# EAGLE schematic V1 (EAGLE 8.5.1)

## Sheet 1 of 2
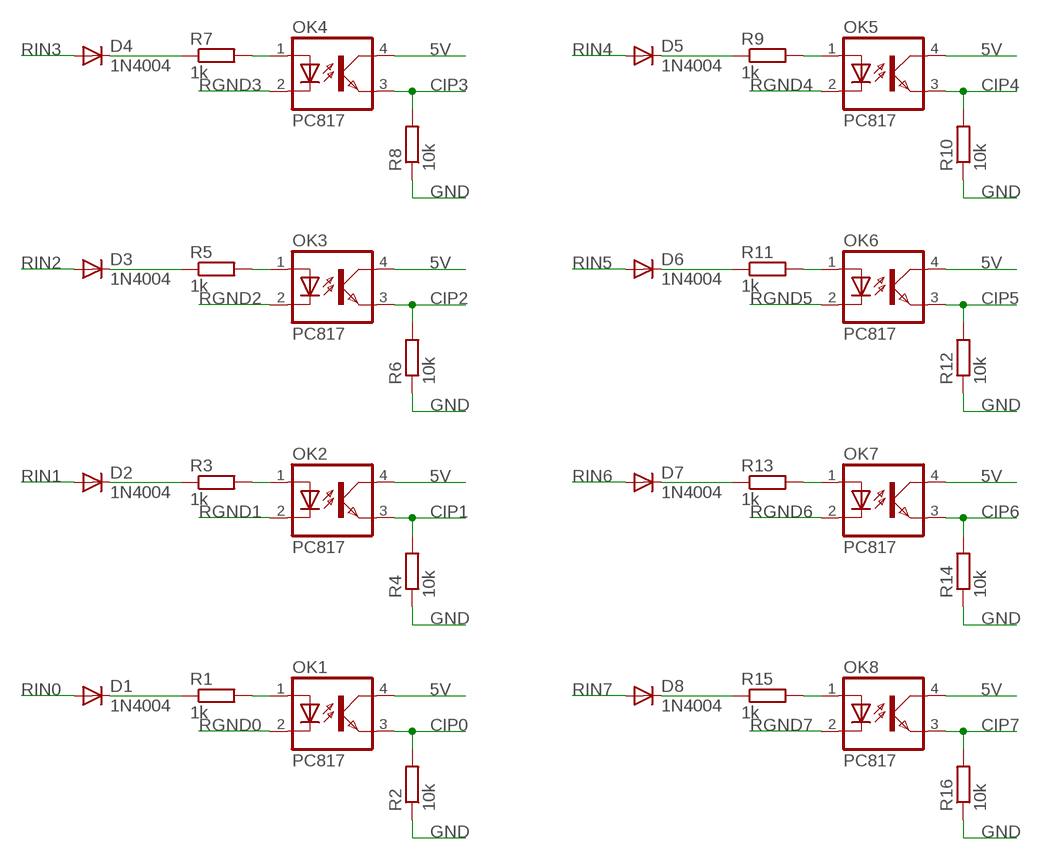
[diagram p0: schematic, sheet 1]

### Parts
D1  1N4004  [DO41-10]
D2  1N4004  [DO41-10]
D3  1N4004  [DO41-10]
D4  1N4004  [DO41-10]
D5  1N4004  [DO41-10]
D6  1N4004  [DO41-10]
D7  1N4004  [DO41-10]
D8  1N4004  [DO41-10]
OK1  PC817  [DIL04]
OK2  PC817  [DIL04]
OK3  PC817  [DIL04]
OK4  PC817  [DIL04]
OK5  PC817  [DIL04]
OK6  PC817  [DIL04]
OK7  PC817  [DIL04]
OK8  PC817  [DIL04]
R1  1k  R-EU_0207/10  [0207/10]
R2  10k  R-EU_0207/10  [0207/10]
R3  1k  R-EU_0207/10  [0207/10]
R4  10k  R-EU_0207/10  [0207/10]
R5  1k  R-EU_0207/10  [0207/10]
R6  10k  R-EU_0207/10  [0207/10]
R7  1k  R-EU_0207/10  [0207/10]
R8  10k  R-EU_0207/10  [0207/10]
R9  1k  R-EU_0207/10  [0207/10]
R10  10k  R-EU_0207/10  [0207/10]
R11  1k  R-EU_0207/10  [0207/10]
R12  10k  R-EU_0207/10  [0207/10]
R13  1k  R-EU_0207/10  [0207/10]
R14  10k  R-EU_0207/10  [0207/10]
R15  1k  R-EU_0207/10  [0207/10]
R16  10k  R-EU_0207/10  [0207/10]

### Nets
5V: OK1.4(COL) OK2.4(COL) OK3.4(COL) OK4.4(COL) OK5.4(COL) OK6.4(COL) OK7.4(COL) OK8.4(COL) ; also sheet 2
CIP0: OK1.3(EMIT) R2.2 ; also sheet 2
CIP1: OK2.3(EMIT) R4.2 ; also sheet 2
CIP2: OK3.3(EMIT) R6.2 ; also sheet 2
CIP3: OK4.3(EMIT) R8.2 ; also sheet 2
CIP4: OK5.3(EMIT) R10.2 ; also sheet 2
CIP5: OK6.3(EMIT) R12.2 ; also sheet 2
CIP6: OK7.3(EMIT) R14.2 ; also sheet 2
CIP7: OK8.3(EMIT) R16.2 ; also sheet 2
GND: R2.1 R4.1 R6.1 R8.1 R10.1 R12.1 R14.1 R16.1 ; also sheet 2
N$1: D1.C R1.1
N$2: OK1.1(A) R1.2
N$3: D2.C R3.1
N$4: OK2.1(A) R3.2
N$5: D3.C R5.1
N$6: OK3.1(A) R5.2
N$7: D4.C R7.1
N$8: OK4.1(A) R7.2
N$9: D5.C R9.1
N$10: OK5.1(A) R9.2
N$11: D6.C R11.1
N$12: OK6.1(A) R11.2
N$13: D7.C R13.1
N$14: OK7.1(A) R13.2
N$15: D8.C R15.1
N$16: OK8.1(A) R15.2
RGND0: OK1.2(C) ; also sheet 2
RGND1: OK2.2(C) ; also sheet 2
RGND2: OK3.2(C) ; also sheet 2
RGND3: OK4.2(C) ; also sheet 2
RGND4: OK5.2(C) ; also sheet 2
RGND5: OK6.2(C) ; also sheet 2
RGND6: OK7.2(C) ; also sheet 2
RGND7: OK8.2(C) ; also sheet 2
RIN0: D1.A ; also sheet 2
RIN1: D2.A ; also sheet 2
RIN2: D3.A ; also sheet 2
RIN3: D4.A ; also sheet 2
RIN4: D5.A ; also sheet 2
RIN5: D6.A ; also sheet 2
RIN6: D7.A ; also sheet 2
RIN7: D8.A ; also sheet 2

## Sheet 2 of 2
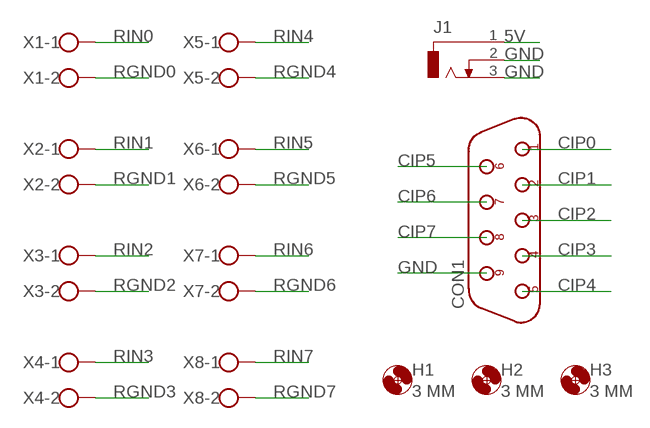
[diagram p1: schematic, sheet 2]

### Parts
CON1  DB9F/90  [D-09F/90]
H1  3 MM  MOUNT-HOLE3.0  [3,0]
H2  3 MM  MOUNT-HOLE3.0  [3,0]
H3  3 MM  MOUNT-HOLE3.0  [3,0]
J1  DCJ0303  [DCJ0303]
X1  W237-102  [W237-102]
X2  W237-102  [W237-102]
X3  W237-102  [W237-102]
X4  W237-102  [W237-102]
X5  W237-102  [W237-102]
X6  W237-102  [W237-102]
X7  W237-102  [W237-102]
X8  W237-102  [W237-102]

### Nets
5V: J1.1 ; also sheet 1
CIP0: CON1.1 ; also sheet 1
CIP1: CON1.2 ; also sheet 1
CIP2: CON1.3 ; also sheet 1
CIP3: CON1.4 ; also sheet 1
CIP4: CON1.5 ; also sheet 1
CIP5: CON1.6 ; also sheet 1
CIP6: CON1.7 ; also sheet 1
CIP7: CON1.8 ; also sheet 1
GND: CON1.9 J1.2 J1.3 ; also sheet 1
RGND0: X1.2 ; also sheet 1
RGND1: X2.2 ; also sheet 1
RGND2: X3.2 ; also sheet 1
RGND3: X4.2 ; also sheet 1
RGND4: X5.2 ; also sheet 1
RGND5: X6.2 ; also sheet 1
RGND6: X7.2 ; also sheet 1
RGND7: X8.2 ; also sheet 1
RIN0: X1.1 ; also sheet 1
RIN1: X2.1 ; also sheet 1
RIN2: X3.1 ; also sheet 1
RIN3: X4.1 ; also sheet 1
RIN4: X5.1 ; also sheet 1
RIN5: X6.1 ; also sheet 1
RIN6: X7.1 ; also sheet 1
RIN7: X8.1 ; also sheet 1

## Library data of the parts
CON1 = connect:DB9F/90
D1-D8 = adafruit:1N4004: DIODE General purpose 1N400x type rectifier (With bigger pads) http://www.ladyada.net/library/pcb/eaglelibrary.html
H1-H3 = holes:MOUNT-HOLE: MOUNTING HOLE with drill center marker
J1 = con-jack:DCJ0303: DC POWER JACK Source: DCJ0303.pdf; OC_FARNELL: unknown; OC_NEWARK: unknown
OK1-OK8 = optocoupler:PC817: SHARP OPTO COUPLER; MPN: PC817X4J000F; OC_FARNELL: 9707727; OC_NEWARK: 97K7059
R1-R16 = rcl:R-EU_: RESISTOR, European symbol; SPICEPREFIX: R
X1-X8 = con-wago-500:W237-102: WAGO SCREW CLAMP; MPN: 237-102; OC_FARNELL: unknown; OC_NEWARK: 70K9898